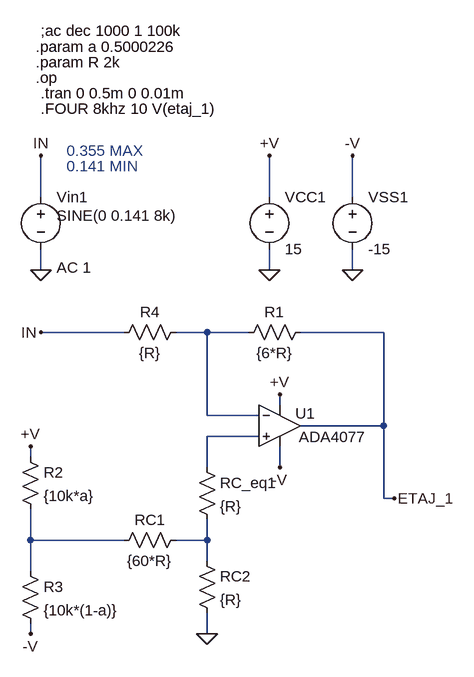
[diagram p0: schematic Liniaritate_ET1.asc]
Liniaritate_ET1.asc, the LTspice schematic file:
Version 4
SHEET 1 880 680
WIRE -144 -160 -144 -224
WIRE 208 -160 208 -224
WIRE 336 -160 336 -224
WIRE -144 -48 -144 -80
WIRE 208 -48 208 -80
WIRE 336 -48 336 -80
WIRE -16 48 -144 48
WIRE 112 48 64 48
WIRE 176 48 112 48
WIRE 384 48 256 48
WIRE 224 160 224 144
WIRE 112 176 112 48
WIRE 192 176 112 176
WIRE 384 192 384 48
WIRE 384 192 256 192
WIRE 192 208 112 208
WIRE -160 240 -160 224
WIRE 112 256 112 208
WIRE 224 256 224 224
WIRE 384 304 384 192
WIRE 400 304 384 304
WIRE -160 368 -160 320
WIRE -16 368 -160 368
WIRE 112 368 112 336
WIRE 112 368 64 368
WIRE 112 400 112 368
WIRE -160 416 -160 368
WIRE -160 512 -160 496
WIRE 112 512 112 480
FLAG -144 -48 0
FLAG -160 224 +V
FLAG -160 512 -V
FLAG -144 -224 IN
FLAG -144 48 IN
FLAG 208 -48 0
FLAG 336 -48 0
FLAG 208 -224 +V
FLAG 336 -224 -V
FLAG 224 256 -V
FLAG 224 144 +V
FLAG 112 512 0
FLAG 400 304 ETAJ_1
DATAFLAG 384 224 ""
SYMBOL voltage -144 -176 R0
WINDOW 123 24 124 Left 2
WINDOW 39 0 0 Left 2
WINDOW 3 24 44 Left 2
SYMATTR Value2 AC 1
SYMATTR Value SINE(0 0.141 8k)
SYMATTR InstName Vin1
SYMBOL res 272 32 R90
WINDOW 0 0 56 VBottom 2
WINDOW 3 32 56 VTop 2
SYMATTR InstName R1
SYMATTR Value {6*R}
SYMBOL res -32 384 R270
WINDOW 0 32 56 VTop 2
WINDOW 3 0 56 VBottom 2
SYMATTR InstName RC1
SYMATTR Value {60*R}
SYMBOL res -176 224 R0
SYMATTR InstName R2
SYMATTR Value {10k*a}
SYMBOL res -176 400 R0
SYMATTR InstName R3
SYMATTR Value {10k*(1-a)}
SYMBOL res 80 32 R90
WINDOW 0 0 56 VBottom 2
WINDOW 3 32 56 VTop 2
SYMATTR InstName R4
SYMATTR Value {R}
SYMBOL voltage 208 -176 R0
WINDOW 123 0 0 Left 2
WINDOW 39 0 0 Left 2
SYMATTR InstName VCC1
SYMATTR Value 15
SYMBOL voltage 336 -176 R0
WINDOW 123 0 0 Left 2
WINDOW 39 0 0 Left 2
SYMATTR InstName VSS1
SYMATTR Value -15
SYMBOL res 96 240 R0
SYMATTR InstName RC_eq1
SYMATTR Value {R}
SYMBOL res 96 384 R0
SYMATTR InstName RC2
SYMATTR Value {R}
SYMBOL OpAmps\\ADA4077 224 128 R0
WINDOW 0 24 45 Left 2
WINDOW 3 29 81 Left 2
SYMATTR InstName U1
TEXT -152 -392 Left 2 !.param a 0.5000226
TEXT -144 -320 Left 2 !.tran 0 0.5m 0 0.01m
TEXT -152 -368 Left 2 !.param R 2k
TEXT -152 -344 Left 2 !.op
TEXT -144 -296 Left 2 !.FOUR 8khz 10 V(etaj_1)
TEXT -104 -232 Left 2 ;0.355 MAX
TEXT -104 -208 Left 2 ;0.141 MIN
TEXT -144 -416 Left 2 !;ac dec 1000 1 100k

The netlist it stands for:
* Liniaritate_ET1.asc
Vin1 IN 0 SINE(0 0.141 8k) AC 1
R1 ETAJ_1 N001 {6*R}
RC1 N003 N004 {60*R}
R2 +V N003 {10k*a}
R3 N003 -V {10k*(1-a)}
R4 N001 IN {R}
VCC1 +V 0 15
VSS1 -V 0 -15
RC_eq1 N002 N004 {R}
RC2 N004 0 {R}
XU1 N002 N001 +V -V ETAJ_1 ADA4077  ; pins In+ In- V+ V- OUT
.param a 0.5000226
.tran 0 0.5m 0 0.01m
.param R 2k
.op
.FOUR 8khz 10 V(etaj_1)
* 0.355 MAX
* 0.141 MIN
;ac dec 1000 1 100k
.backanno
.end